# Altium project SensorBoard_RobotDog.PrjPcb
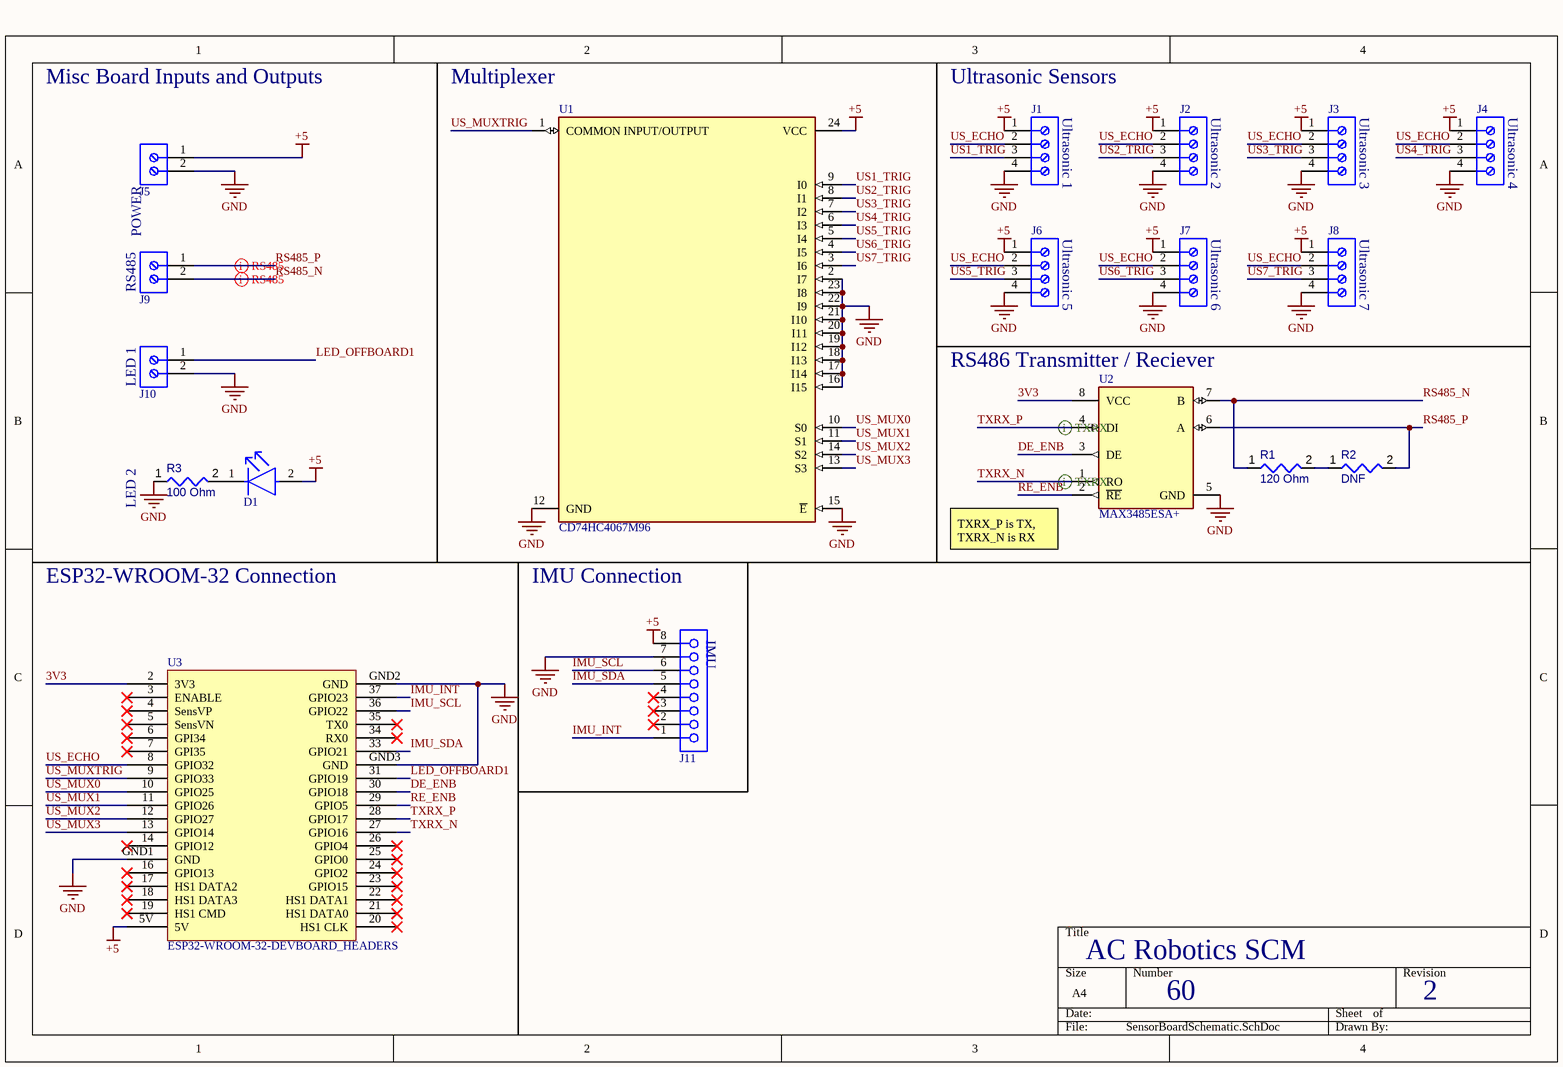
[diagram p0: SensorBoardSchematic.SchDoc]
1 sheet, 18 parts. Net scope: global (net labels, ports and power ports of the same name join across sheets).
Board file: SensorBoardPCB.PcbDoc

## Sheet SensorBoardSchematic.SchDoc
size A4

### Parts
D1  LTST-C190KFKT  [FP-LTST-C190KFKT-MFG]  (value not drawn)
J1  691709710304  [691709710304]  (value not drawn)
J2  691709710304  [691709710304]  (value not drawn)
J3  691709710304  [691709710304]  (value not drawn)
J4  691709710304  [691709710304]  (value not drawn)
J5  691102710002  [691102710002]  (value not drawn)
J6  691709710304  [691709710304]  (value not drawn)
J7  691709710304  [691709710304]  (value not drawn)
J8  691709710304  [691709710304]  (value not drawn)
J9  691102710002  [691102710002]  (value not drawn)
J10  691102710002  [691102710002]  (value not drawn)
J11  SSQ-108-01-T-S  [SMTC-SSQ-108-01-X-S]  (value not drawn)
R1  120 Ohm  [RESC0603(1608)_L]
R2  DNF  [RESC0603(1608)_L]
R3  100 Ohm  [RESC0603(1608)_L]
U1  CD74HC4067M96  [FP-DW0024A-MFG]
U2  MAX3485ESA+  [FP-S8-5-MFG]
U3  ESP32-WROOM-32-DEVBOARD_HEADERS  [ESP32-WROOM-32-DEVBOARD_HEADERS-Footprint-1]

### Nets
+5: D1.2(A) J1.1 J2.1 J3.1 J4.1 J5.1 J6.1 J7.1 J8.1 J11.8 U1.24(VCC) U3.5V
GND: J1.4 J2.4 J3.4 J4.4 J5.2 J6.4 J7.4 J8.4 J10.2 J11.7 R3.1 U1.2(I7) U1.12(GND) U1.15(~{E}) U1.16(I15) U1.17(I14) U1.18(I13) U1.19(I12) U1.20(I11) U1.21(I10) U1.22(I9) U1.23(I8) U2.5(GND) U3.GND1(GND) U3.GND2(GND) U3.GND3(GND)
3V3: U2.8(VCC) U3.2(3V3)
DE_ENB: U2.3(DE) U3.30(GPIO18)
IMU_INT: J11.1 U3.37(GPIO23)
IMU_SCL: J11.6 U3.36(GPIO22)
IMU_SDA: J11.5 U3.33(GPIO21)
LED_OFFBOARD1: J10.1 U3.31(GPIO19)
RE_ENB: U2.2(~{RE}) U3.29(GPIO5)
RS485_N: J9.2 R1.1 U2.7(B)
RS485_P: J9.1 R2.2 U2.6(A)
TXRX_N: U2.1(RO) U3.27(GPIO16)
TXRX_P: U2.4(DI) U3.28(GPIO17)
US1_TRIG: J1.3 U1.9(I0)
US2_TRIG: J2.3 U1.8(I1)
US3_TRIG: J3.3 U1.7(I2)
US4_TRIG: J4.3 U1.6(I3)
US5_TRIG: J6.3 U1.5(I4)
US6_TRIG: J7.3 U1.4(I5)
US7_TRIG: J8.3 U1.3(I6)
US_ECHO: J1.2 J2.2 J3.2 J4.2 J6.2 J7.2 J8.2 U3.8(GPIO32)
US_MUX0: U1.10(S0) U3.10(GPIO25)
US_MUX1: U1.11(S1) U3.11(GPIO26)
US_MUX2: U1.14(S2) U3.12(GPIO27)
US_MUX3: U1.13(S3) U3.13(GPIO14)
US_MUXTRIG: U1.1(COMMON_INPUT/OUTPUT) U3.9(GPIO33)
NetD1_1: D1.1(C) R3.2
NetR1_2: R1.2 R2.1

Not connected (* = marked no-connect by the designer): J11 2* 3* 4*; U3 3(ENABLE)* 4(SensVP)* 5(SensVN)* 6(GPI34)* 7(GPI35)* 14(GPIO12)* 16(GPIO13)* 17(HS1_DATA2)* 18(HS1_DATA3)* 19(HS1_CMD)* 20(HS1_CLK)* 21(HS1_DATA0)* 22(HS1_DATA1)* 23(GPIO15)* 24(GPIO2)* 25(GPIO0)* 26(GPIO4)* 34(RX0)* 35(TX0)*

### Layout directives
differential pair: RS485_N, RS485_P, TXRX_N, TXRX_P

### Notes on the sheet
- Misc Board Inputs and Outputs
- (near U1) Multiplexer
- Ultrasonic Sensors
- (near J1) Ultrasonic 1
- (near J2) Ultrasonic 2
- (near J3) Ultrasonic 3
- (near J4) Ultrasonic 4
- (near J5) POWER
- (near J6) Ultrasonic 5
- (near J7) Ultrasonic 6
- (near J8) Ultrasonic 7
- (near J9) RS485
- (near J10) LED 1
- (near U2) RS486 Transmitter / Reciever
- (near R3) LED 2
- (near U2) TXRX_P is TX, TXRX_N is RX
- ESP32-WROOM-32 Connection
- IMU Connection
- (near J11) IMU
- AC Robotics SCM
- 60
- 2

### Library data of the parts
D1 = CMP-1674-00008-2: LED ORANGE CLEAR CHIP SMD; Number of LEDs: 1; Reverse Voltage: 5V; Power Rating: 75mW; Lens Style: Diffused; Wavelength: 611nm; Forward Voltage: 2V; Test Current: 20mA; Lens Color: Colorless; Dominant Wavelength: 605nm; Forward Current: 30mA; Viewing Angle: 130°; Luminous Intensity: 90mcd; Depth: 1.6mm; Length: 3.2mm; Width: 0.8mm; Lead Free: Lead Free; Height: 0.8mm; Radiation Hardening: No; Max Operating Temperature: 85°C; Illumination Color: Orange; Power Dissipation: 75mW; Packaging: Tape and Reel; Lens Transparency: Clear; Min Operating Temperature: -55°C; Package Quantity: 1; Case Code (Metric): 1608; Number of Pins: 2; Case Code (Imperial): 0603; Case/Package: 0603; Number of Elements: 1; Color: Orange; Mount: Surface Mount
J1-J4 J6-J8 = CMP-1502-03337-1: Serie 7097 - 5.00 mm Horizontal Entry SMT with Pressure Clamp WR-TBL, 4 pin; Manufacturer: Wurth Elektronik; Pin Number: 4; Pitch: 5.00mm; Mounting Technology: SMT; Package Reference: 691709710304; Datasheet URL: http://katalog.we-online.de/em/datasheet/6917097103xx.pdf; Packaging: TapeandReelwithCap; Part Number: 691709710304; Operating Temperature: -45to130degC; Publisher: WurthElektronik; Manufacturer URL: http://www.we-online.de
J5 J9 J10 = CMP-1502-03258-1: Series 102 - 5.00 mm Horizontal Entry Modular with Pressure Clamp WR-TBL, 2 pin; Manufacturer: Wurth Elektronik; Pin Number: 2; Pitch: 5.00mm; Manufacturer URL: http://www.we-online.de; Mounting Technology: THT; Publisher: WurthElektronik; Packaging: Box; Package Reference: 691102710002; Datasheet URL: http://katalog.we-online.de/em/datasheet/6911027100xx.pdf; Operating Temperature: -40to105degC; Part Number: 691102710002
J11 = CMP-1023-00293-1: SQ Post Socket, Through-hole, Vertical, -55 to 105 degC, 2.54 mm Pitch, 8-Pin, Female, RoHS; Manufacturer: Samtec; Pitch: 2.54 mm; ComponentLink2URL: http://www.samtec.com/documents/webfiles/pdf/SSQ_TH.PDF; RoHS: True; PartNumber: SSQ-108-01-T-S; ComponentLink1Description: Manufacturer URL; PackageDescription: Assembly, Socket Strip .025[0.64] SQ Tail; Mounting Technology: Through-hole; ComponentLink3URL: http://www.samtec.com/documents/webfiles/cpdf/SSQ-1XX-XX-XXX-X-XX-XXX-XX-X-MKT.pdf; Orientation: Vertical; Temperature Range: -55 to 105 degC; ComponentLink1URL: http://www.samtec.com; ComponentLink2Description: Datasheet; PackageVersion: BD, 6/1987; PackageReference: SSQ-108-01-X-S; ComponentLink3Description: Package Specification; DatasheetVersion: F-214
R1-R3 = CMP-009-00175-3: Jumper 0603; Value: 100; Pins: 2; Min Operating Temperature: -55°C; Max Operating Temperature: 155°C; Case/Package: 0603
U1 = CMP-04901-000007-1: IC MUX/DEMUX 1X16 24SOIC; Manufacturer: Texas Instruments; Standoff Height: 0.1mm; Logic Function Desc: Non-Inverting; Max Supply Voltage: 6V; Number Of Inputs: 16; Quiescent Current: 8uA; Number Of Circuits: 1; Propagation Delay: 6ns; Max Junction Temp: +150°C; Min Supply Voltage: 2V; ComponentLink2Description: Datasheet; Octopart: https://octopart.com/cd74hc4067m96-texas+instruments-722802; Ambient Temperature Range High: +125°C; Ipc Land Pattern Name: SOIC127P1030X265-24; Height: 2.65mm; Mouser Description: Multiplexer Switch ICs Hi-Spd CMOS 16Ch Anl Mltplxr/Demltplxr; Temperature Range Low: -55°C; Package: DW0024A; Temperature Range High: +125°C; Lead Free: Yes; ComponentLink2URL: http://www.ti.com/lit/ds/symlink/cd74hc4067.pdf; Manufacturer Part Number: CD74HC4067M96; RoHS: TRUE; Automotive: No; Device Class L1: Integrated Circuits (ICs); Digikey Description: IC MUX/DEMUX 1X16 24SOIC; Device Class L2: Logic ICs; Temperature: -55°C to +125°C; Device Class L3: Multiplexers; Category: IC; Ambient Temperature Range Low: -55°C; Number Of Outputs: 1
U2 = CMP-05679-000020-1: IC TXRX RS485/422 10MBPS 8SOIC; Manufacturer: Maxim Integrated; Nominal Supply Current: 0.95-1.1mA; Data Rate: 10Mbits/s; Min Supply Voltage: 3V; Interface: RS-485,RS-422; Number Of Transmitters: 1; Max Supply Voltage: 3.6V; Max Junction Temp: +160°C; Standoff Height: 0.1mm; Simplex Duplex: Half Duplex; Height: 1.75mm; Temperature Range High: +85°C; Device Class L2: Interface ICs; Digikey Description: IC TXRX RS485/422 10MBPS 8SOIC; Temperature: -40°C to +85°C; Device Class L3: RS-232 / RS-422 / RS-485 Interface ICs; Temperature Range Low: -40°C; Footprint Url: https://pdfserv.maximintegrated.com/land_patterns/90-0096.PDF; Category: IC; ComponentLink2URL: https://datasheets.maximintegrated.com/en/ds/MAX3483-MAX3491.pdf; Package: S8-5; Octopart: https://octopart.com/max3485esa%2B-maxim+integrated-39731860; RoHS: TRUE; Manufacturer Part Number: MAX3485ESA+; Lead Free: Yes; ComponentLink2Description: Datasheet; Device Class L1: Integrated Circuits (ICs); Mouser Description: 3.3V Powered, 10Mbps and Slew-Rate Limited, True RS-485/RS-422 Transceivers; Number Of Receivers: 1; Automotive: No
U3 = CMP-002-00073-6: Made by Aleksander